# Altium schematic sheet Top.SchDoc: TOP
size A4; DocumentNumber: 1; SheetNumber: 1; SheetTotal: 18
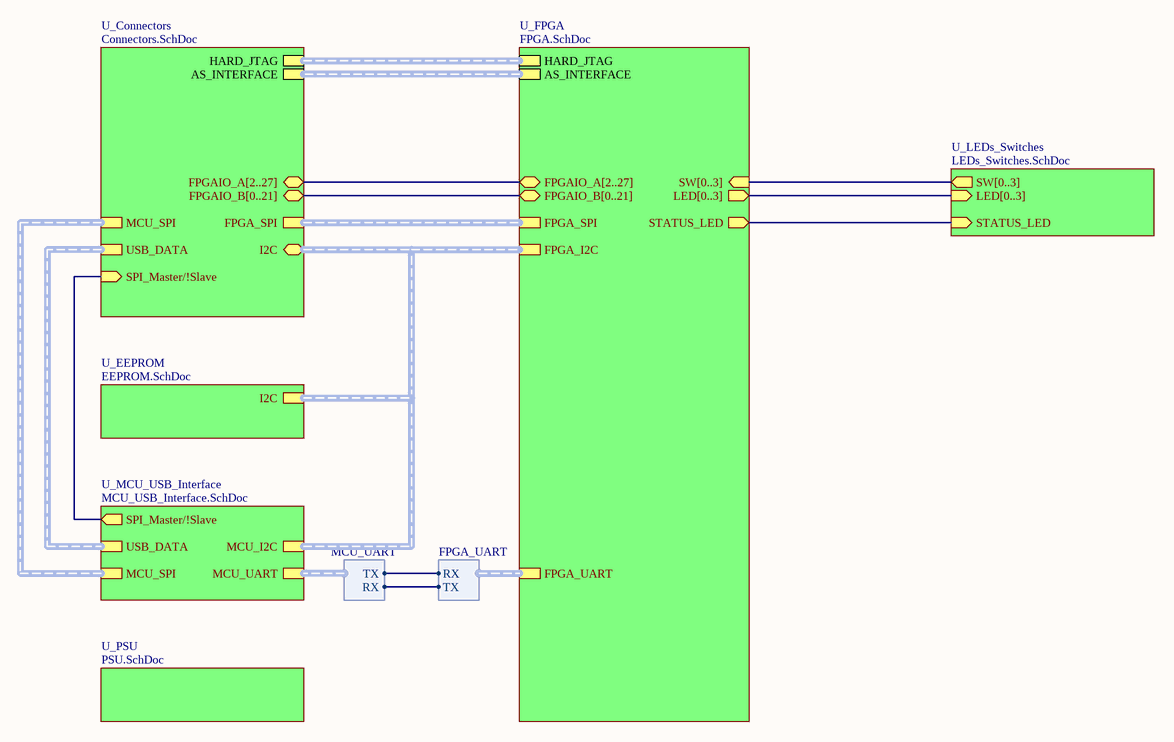
[diagram p0: Top.SchDoc]

## Sub-sheets
U_Connectors = Connectors.SchDoc: HARD_JTAG (harness HARD_JTAG), AS_INTERFACE (harness AS_INTERFACE), FPGAIO_A[2..27] (bidir), FPGAIO_B[0..21] (bidir, harness TEST_INT), USB_DATA (harness USB_DATA), FPGA_SPI (harness FPGA_SPI), MCU_SPI (harness MCU_SPI), I2C (harness I2C), SPI_Master/!Slave (in)
U_EEPROM = EEPROM.SchDoc: I2C (harness I2C)
U_FPGA = FPGA.SchDoc: HARD_JTAG (harness HARD_JTAG), AS_INTERFACE (harness AS_INTERFACE), STATUS_LED (out), FPGA_SPI (harness FPGA_SPI), FPGA_I2C (harness I2C), FPGAIO_A[2..27] (bidir), FPGAIO_B[0..21] (bidir, harness TEST_INT), FPGA_UART (harness FPGA_UART), SW[0..3] (in), LED[0..3] (out)
U_LEDs_Switches = LEDs_Switches.SchDoc: SW[0..3] (out), LED[0..3] (in), STATUS_LED (in)
U_MCU_USB_Interface = MCU_USB_Interface.SchDoc: USB_DATA (harness USB_DATA), MCU_SPI (harness MCU_SPI), MCU_I2C (harness I2C), MCU_UART (harness MCU_UART), SPI_Master/!Slave (out)
U_PSU = PSU.SchDoc: no entries

## Harnesses
MCU_UART: TX, RX
FPGA_UART: TX, RX

## Nets
(unnamed): sheet U_LEDs_Switches/STATUS_LED, sheet U_FPGA/STATUS_LED
(unnamed): sheet U_MCU_USB_Interface/SPI_Master/!Slave, sheet U_Connectors/SPI_Master/!Slave
(unnamed): sheet U_MCU_USB_Interface/MCU_UART.TX, sheet U_FPGA/FPGA_UART.RX
(unnamed): sheet U_MCU_USB_Interface/MCU_UART.RX, sheet U_FPGA/FPGA_UART.TX

## Buses and harness runs
bus sheet U_Connectors/FPGAIO_A[2..27] = sheet U_FPGA/FPGAIO_A[2..27]
bus sheet U_FPGA/LED[0..3] = sheet U_LEDs_Switches/LED[0..3]
bus sheet U_FPGA/SW[0..3] = sheet U_LEDs_Switches/SW[0..3]
harness sheet U_Connectors/AS_INTERFACE = sheet U_FPGA/AS_INTERFACE
harness sheet U_Connectors/FPGA_SPI = sheet U_FPGA/FPGA_SPI
harness sheet U_Connectors/HARD_JTAG = sheet U_FPGA/HARD_JTAG
harness sheet U_Connectors/I2C = sheet U_EEPROM/I2C = sheet U_FPGA/FPGA_I2C = sheet U_MCU_USB_Interface/MCU_I2C
harness sheet U_Connectors/MCU_SPI = sheet U_MCU_USB_Interface/MCU_SPI
harness sheet U_Connectors/USB_DATA = sheet U_MCU_USB_Interface/USB_DATA

## Notes on the sheet
- Title
- Size:
- Date:
- A4
- Number:
- Time:
- Revision:
- Sheet
- of
- File: